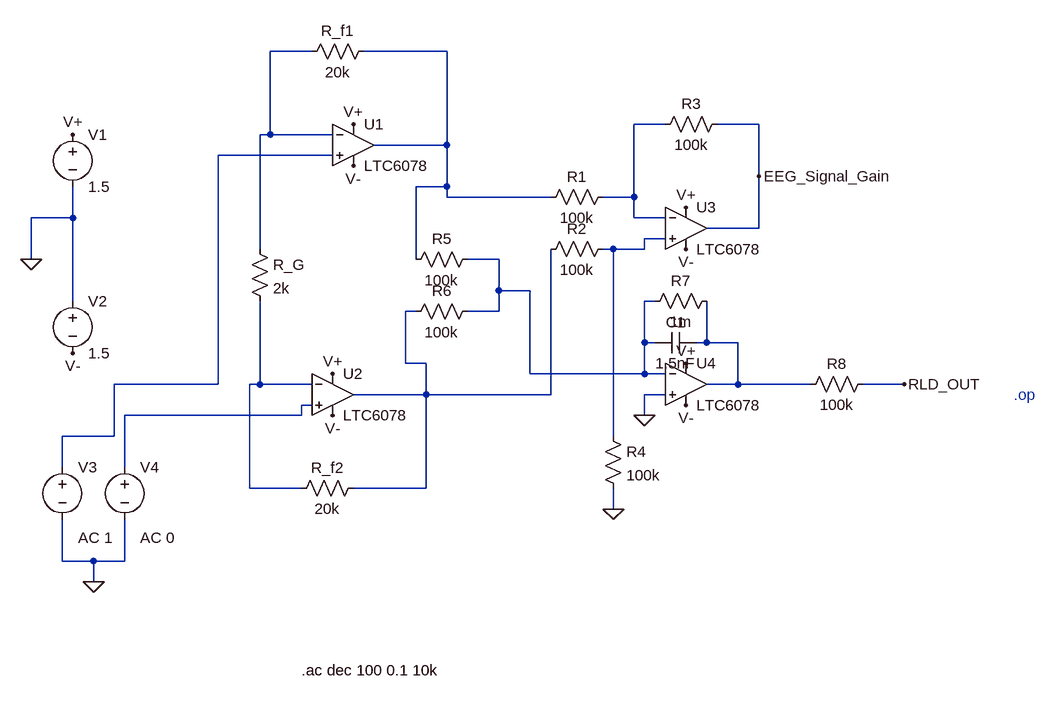
[diagram p0: schematic eeg-afe-project.asc]
eeg-afe-project.asc, the LTspice schematic file:
Version 4.1
SHEET 1 1008 712
WIRE -112 -256 -176 -256
WIRE 96 -256 -32 -256
WIRE 432 -144 384 -144
WIRE 576 -144 512 -144
WIRE -176 -128 -176 -256
WIRE -176 -128 -192 -128
WIRE -80 -128 -176 -128
WIRE 96 -112 96 -256
WIRE 96 -112 -16 -112
WIRE -80 -96 -256 -96
WIRE 576 -64 576 -144
WIRE 96 -48 96 -112
WIRE 96 -48 48 -48
WIRE 96 -32 96 -48
WIRE 256 -32 96 -32
WIRE 384 -32 384 -144
WIRE 384 -32 336 -32
WIRE -480 0 -480 -48
WIRE -480 0 -544 0
WIRE 384 0 384 -32
WIRE 432 0 384 0
WIRE 576 16 576 -64
WIRE 576 16 496 16
WIRE 432 32 400 32
WIRE -192 48 -192 -128
WIRE 352 48 336 48
WIRE 400 48 400 32
WIRE 400 48 352 48
WIRE -544 64 -544 0
WIRE 48 64 48 -48
WIRE 176 64 128 64
WIRE 176 112 176 64
WIRE 224 112 176 112
WIRE -480 128 -480 0
WIRE 416 128 400 128
WIRE 48 144 32 144
WIRE 176 144 176 112
WIRE 176 144 128 144
WIRE 400 192 400 128
WIRE 416 192 400 192
WIRE 496 192 496 128
WIRE 496 192 480 192
WIRE 544 192 496 192
WIRE 32 224 32 144
WIRE 64 224 32 224
WIRE 224 240 224 112
WIRE 400 240 400 192
WIRE 400 240 224 240
WIRE 432 240 400 240
WIRE -256 256 -256 -96
WIRE -256 256 -416 256
WIRE -192 256 -192 128
WIRE -192 256 -208 256
WIRE -112 256 -192 256
WIRE 544 256 544 192
WIRE 544 256 496 256
WIRE 656 256 544 256
WIRE 800 256 736 256
WIRE 64 272 64 224
WIRE 64 272 -48 272
WIRE 256 272 256 48
WIRE 256 272 64 272
WIRE 432 272 400 272
WIRE -112 288 -128 288
WIRE -128 304 -128 288
WIRE -128 304 -400 304
WIRE 400 304 400 272
WIRE -416 336 -416 256
WIRE -416 336 -496 336
WIRE 352 336 352 48
WIRE -496 384 -496 336
WIRE -400 384 -400 304
WIRE -208 416 -208 256
WIRE -128 416 -208 416
WIRE 64 416 64 272
WIRE 64 416 -48 416
WIRE 352 448 352 416
WIRE -496 528 -496 464
WIRE -448 528 -496 528
WIRE -400 528 -400 464
WIRE -400 528 -448 528
WIRE -448 560 -448 528
FLAG 400 304 0
FLAG 352 448 0
FLAG -544 64 0
FLAG -480 -128 V+
FLAG -48 -144 V+
FLAG 464 -16 V+
FLAG 464 224 V+
FLAG -80 240 V+
FLAG -480 208 V-
FLAG -80 304 V-
FLAG -48 -80 V-
FLAG 464 48 V-
FLAG 464 288 V-
FLAG -448 560 0
FLAG 800 256 RLD_OUT
FLAG 576 -64 EEG_Signal_Gain
SYMBOL OpAmps\\LTC6078 -48 -112 R0
SYMATTR InstName U1
SYMBOL OpAmps\\LTC6078 -80 272 R0
SYMATTR InstName U2
SYMBOL OpAmps\\LTC6078 464 16 R0
SYMATTR InstName U3
SYMBOL OpAmps\\LTC6078 464 256 R0
SYMATTR InstName U4
SYMBOL voltage -480 -144 R0
WINDOW 123 0 0 Left 0
WINDOW 39 0 0 Left 0
SYMATTR InstName V1
SYMATTR Value 1.5
SYMBOL voltage -480 112 R0
WINDOW 123 0 0 Left 0
WINDOW 39 0 0 Left 0
SYMATTR InstName V2
SYMATTR Value 1.5
SYMBOL res -16 -272 R90
WINDOW 0 0 56 VBottom 2
WINDOW 3 32 56 VTop 2
SYMATTR InstName R_f1
SYMATTR Value 20k
SYMBOL res -32 400 R90
WINDOW 0 0 56 VBottom 2
WINDOW 3 32 56 VTop 2
SYMATTR InstName R_f2
SYMATTR Value 20k
SYMBOL res -208 32 R0
SYMATTR InstName R_G
SYMATTR Value 2k
SYMBOL res 352 -48 R90
WINDOW 0 0 56 VBottom 2
WINDOW 3 32 56 VTop 2
SYMATTR InstName R1
SYMATTR Value 100k
SYMBOL res 352 32 R90
WINDOW 0 0 56 VBottom 2
WINDOW 3 32 56 VTop 2
SYMATTR InstName R2
SYMATTR Value 100k
SYMBOL res 528 -160 R90
WINDOW 0 0 56 VBottom 2
WINDOW 3 32 56 VTop 2
SYMATTR InstName R3
SYMATTR Value 100k
SYMBOL res 336 320 R0
SYMATTR InstName R4
SYMATTR Value 100k
SYMBOL res 144 48 R90
WINDOW 0 0 56 VBottom 2
WINDOW 3 32 56 VTop 2
SYMATTR InstName R5
SYMATTR Value 100k
SYMBOL res 144 128 R90
WINDOW 0 0 56 VBottom 2
WINDOW 3 32 56 VTop 2
SYMATTR InstName R6
SYMATTR Value 100k
SYMBOL res 512 112 R90
WINDOW 0 0 56 VBottom 2
WINDOW 3 32 56 VTop 2
SYMATTR InstName R7
SYMATTR Value 1m
SYMBOL cap 480 176 R90
WINDOW 0 0 32 VBottom 2
WINDOW 3 32 32 VTop 2
SYMATTR InstName C1
SYMATTR Value 1.5nF
SYMBOL res 752 240 R90
WINDOW 0 0 56 VBottom 2
WINDOW 3 32 56 VTop 2
SYMATTR InstName R8
SYMATTR Value 100k
SYMBOL voltage -496 368 R0
WINDOW 123 24 124 Left 2
WINDOW 39 0 0 Left 0
SYMATTR InstName V3
SYMATTR Value ""
SYMATTR Value2 AC 1
SYMBOL voltage -400 368 R0
WINDOW 123 24 124 Left 2
WINDOW 39 0 0 Left 0
SYMATTR InstName V4
SYMATTR Value ""
SYMATTR Value2 AC 0
TEXT 968 272 Left 2 ;.op
TEXT -128 696 Left 2 !.ac dec 100 0.1 10k

The netlist it stands for:
* eeg-afe-project.asc
X§U1 N004 N001 V+ V- N002 LTC6078  ; pins IN+ IN- VCC VEE OUT
X§U2 N010 N009 V+ V- N007 LTC6078  ; pins IN+ IN- VCC VEE OUT
X§U3 N005 N003 V+ V- EEG_Signal_Gain LTC6078  ; pins IN+ IN- VCC VEE OUT
X§U4 0 N006 V+ V- N008 LTC6078  ; pins IN+ IN- VCC VEE OUT
V1 V+ 0 1.5
V2 0 V- 1.5
R_f1 N002 N001 20k
R_f2 N007 N009 20k
R_G N001 N009 2k
R1 N003 N002 100k
R2 N005 N007 100k
R3 EEG_Signal_Gain N003 100k
R4 N005 0 100k
R5 N006 N002 100k
R6 N006 N007 100k
R7 N008 N006 1m
C1 N008 N006 1.5nF
R8 RLD_OUT N008 100k
V3 N004 0 AC 1
V4 N010 0 AC 0
* .op
.ac dec 100 0.1 10k
.lib LTC5.lib
.backanno
.end